# Altium project BaseModule.PrjPcb
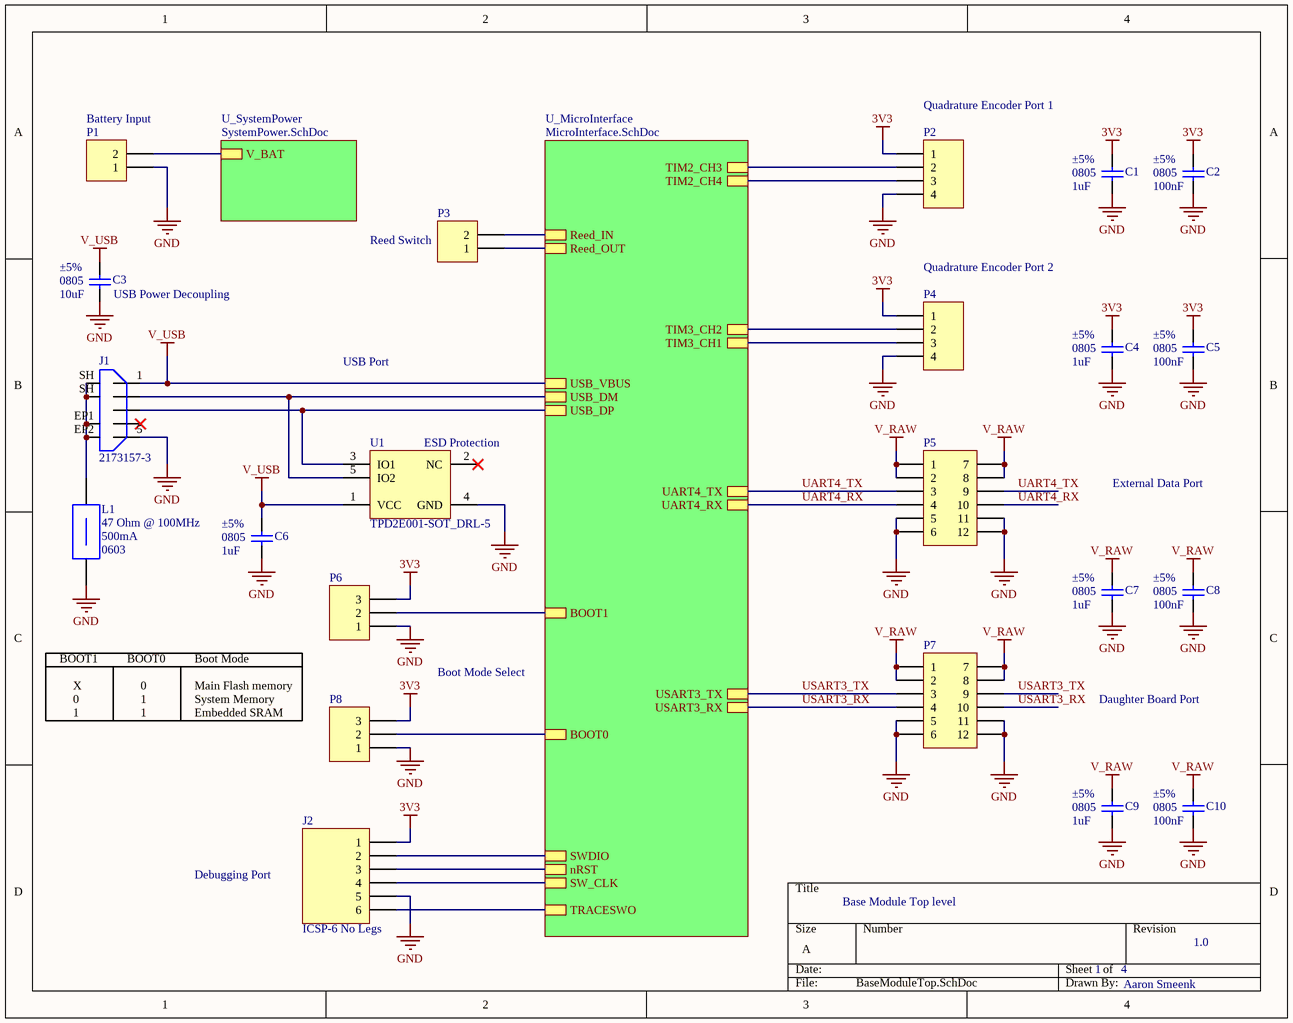
[diagram p0: BaseModuleTop.SchDoc]
4 sheets, 67 parts. Net scope: hierarchical (ports join the sheet entries above them; power ports are global).
Sheets:
  BaseModuleTop.SchDoc
    U_MicroInterface = MicroInterface.SchDoc
      U_Power = Power.SchDoc
    U_SystemPower = SystemPower.SchDoc

## Sheet BaseModuleTop.SchDoc
size A

### Parts
C1  value 1uF  Tolerance: ±5%  Case-EIA: 0805  [CAPC0805(2012)100_M]  (hidden comment: CAP 1uF 6.3V 0805(2012))
C2  value 100nF  Tolerance: ±5%  Case-EIA: 0805  [CAPC0805(2012)100_L]  (hidden comment: CAP 100nF 6.3V 0805(2012))
C3  value 10uF  Tolerance: ±5%  Case-EIA: 0805  [CAPC0805(2012)100_M]  (hidden comment: CAP 10uF 6.3V 0805(2012))
C4  value 1uF  Tolerance: ±5%  Case-EIA: 0805  [CAPC0805(2012)100_M]  (hidden comment: CAP 1uF 6.3V 0805(2012))
C5  value 100nF  Tolerance: ±5%  Case-EIA: 0805  [CAPC0805(2012)100_L]  (hidden comment: CAP 100nF 6.3V 0805(2012))
C6  value 1uF  Tolerance: ±5%  Case-EIA: 0805  [CAPC0805(2012)100_M]  (hidden comment: CAP 1uF 6.3V 0805(2012))
C7  value 1uF  Tolerance: ±5%  Case-EIA: 0805  [CAPC0805(2012)100_M]  (hidden comment: CAP 1uF 6.3V 0805(2012))
C8  value 100nF  Tolerance: ±5%  Case-EIA: 0805  [CAPC0805(2012)100_L]  (hidden comment: CAP 100nF 6.3V 0805(2012))
C9  value 1uF  Tolerance: ±5%  Case-EIA: 0805  [CAPC0805(2012)100_M]  (hidden comment: CAP 1uF 6.3V 0805(2012))
C10  value 100nF  Tolerance: ±5%  Case-EIA: 0805  [CAPC0805(2012)100_L]  (hidden comment: CAP 100nF 6.3V 0805(2012))
J1  2173157-3  [2173157-3]
J2  ICSP-6 No Legs  [TC2030-IDC-NL]
L1  Impedance @ Frequency: 47 Ohm @ 100MHz  Current Rating: 500mA  Package / Case: 0603  [LI0603E470R-10]  (hidden comment: LI0603E470R-10)
P1  Header 2  [HDR1X2]  (value not drawn)
P2  Header 4  [HDR1X4]  (value not drawn)
P3  Header 2  [HDR1X2]  (value not drawn)
P4  Header 4  [HDR1X4]  (value not drawn)
P5  Header 6X2A  [HDR2X6_CEN]  (value not drawn)
P6  Header 3  [HDR1X3]  (value not drawn)
P7  Header 6X2A  [HDR2X6_CEN]  (value not drawn)
P8  Header 3  [HDR1X3]  (value not drawn)
U1  TPD2E001-SOT_DRL-5  [TPD2E001DRLR]

### Sub-sheets
U_MicroInterface = MicroInterface.SchDoc: UART4_TX, UART4_RX, USART3_TX, USART3_RX, SWDIO, SW_CLK, TRACESWO, BOOT1, BOOT0, USB_DP, USB_DM, USB_VBUS, nRST, TIM3_CH1, TIM3_CH2, TIM2_CH4, TIM2_CH3, Reed_IN, Reed_OUT
U_SystemPower = SystemPower.SchDoc: V_BAT

### Nets
3V3: C1.2 C2.2 C4.2 C5.2 J2.1 P2.1 P4.1 P6.3 P8.3
GND: C1.1 C2.1 C3.1 C4.1 C5.1 C6.1 C7.1 C8.1 C9.1 C10.1 J1.5(GND) J2.5 L1.1 P1.1 P2.4 P4.4 P5.5 P5.6 P5.11 P5.12 P6.1 P7.5 P7.6 P7.11 P7.12 P8.1 U1.4(GND)
V_RAW: C7.2 C8.2 C9.2 C10.2 P5.1 P5.2 P5.7 P5.8 P7.1 P7.2 P7.7 P7.8
V_USB: C3.2 C6.2 J1.1(5V) U1.1(VCC) ; sheet U_MicroInterface/USB_VBUS
UART4_RX: P5.4 P5.10 ; sheet U_MicroInterface/UART4_RX
UART4_TX: P5.3 P5.9 ; sheet U_MicroInterface/UART4_TX
USART3_RX: P7.4 P7.10 ; sheet U_MicroInterface/USART3_RX
USART3_TX: P7.3 P7.9 ; sheet U_MicroInterface/USART3_TX
NetC16_2: J2.3 ; sheet U_MicroInterface/nRST
NetJ1_2: J1.2(D-) U1.5(IO2) ; sheet U_MicroInterface/USB_DM
NetJ1_3: J1.3(D+) U1.3(IO1) ; sheet U_MicroInterface/USB_DP
NetJ1_EP1: J1.EP1 J1.EP2 J1.SH L1.2
NetJ2_2: J2.2 ; sheet U_MicroInterface/SWDIO
NetJ2_4: J2.4 ; sheet U_MicroInterface/SW_CLK
NetJ2_6: J2.6 ; sheet U_MicroInterface/TRACESWO
NetP1_2: P1.2 ; sheet U_SystemPower/V_BAT
NetP2_2: P2.2 ; sheet U_MicroInterface/TIM2_CH3
NetP2_3: P2.3 ; sheet U_MicroInterface/TIM2_CH4
NetP3_1: P3.1 ; sheet U_MicroInterface/Reed_OUT
NetP3_2: P3.2 ; sheet U_MicroInterface/Reed_IN
NetP4_2: P4.2 ; sheet U_MicroInterface/TIM3_CH2
NetP4_3: P4.3 ; sheet U_MicroInterface/TIM3_CH1
NetP6_2: P6.2 ; sheet U_MicroInterface/BOOT1
NetP8_2: P8.2 ; sheet U_MicroInterface/BOOT0

Not connected (* = marked no-connect by the designer): J1 4(ID)*; U1 2(NC)*

### Notes on the sheet
- (near P1) Battery Input
- (near P2) Quadrature Encoder Port 1
- (near C3) USB Power Decoupling
- (near P3) Reed Switch
- (near P4) Quadrature Encoder Port 2
- USB Port
- (near U1) ESD Protection
- External Data Port
- BOOT1
- X
- 0
- BOOT0
- 1
- Boot Mode
- Main Flash memory
- System Memory
- Boot Mode Select
- Daughter Board Port
- Embedded SRAM
- Debugging Port
- Base Module Top level
- 4
- 1.0
- Aaron Smeenk

### Library data of the parts
C1 C4 C6 C7 C9 = CMP-1036-04730-1: CAP 1uF 6.3V ±5% 0805 (2012 Metric) Thickness 1mm SMD; Case-Metric: 2012; Technology: SMT; Max Thickness: 1 mm; Rated Voltage: 6.3 V
C2 C5 C8 C10 = CMP-1036-04390-1: CAP 100nF 6.3V ±5% 0805 (2012 Metric) Thickness 1mm SMD; Case-Metric: 2012; Rated Voltage: 6.3 V; Technology: SMT; Max Thickness: 1 mm
C3 = CMP-1036-04730-1: CAP 10uF 6.3V ±5% 0805 (2012 Metric) Thickness 1mm SMD; Case-Metric: 2012; Technology: SMT; Max Thickness: 1 mm; Rated Voltage: 6.3 V
J1 = 2173157-3: USB Connectors SPLASH PROOF MICRO 5P USB B-TYPE; Number of Ports: 1; Number of Contacts: 5; Gender: Female; Brand: TE Connectivity; Mounting Angle: Right; Product: Micro USB Type B Connectors; Standard: USB 2.0; Termination Style: SMD; Contact Material: Copper Alloy; Contact Plating: Gold; Shell Plating: Tin
J2 = ICSP-6 No Legs: 6 Pin Connector
L1 = LI0603E470R-10: FERRITE CHIP 47 OHMS 500MA 0603; DC Resistance (DCR): 100 mOhm Max; Filter Type: Differential Mode - Single; Height (Max): 0.037" (0.95mm)
P1 P3 = Header 2: Header, 2-Pin; LatestRevisionDate: 17-Jul-2002; LatestRevisionNote: Re-released for DXP Platform.; Publisher: Altium Limited
P2 P4 = Header 4: Header, 4-Pin; LatestRevisionDate: 17-Jul-2002; LatestRevisionNote: Re-released for DXP Platform.; Publisher: Altium Limited
P5 P7 = Header 6X2A: Header, 6-Pin, Dual row; LatestRevisionDate: 17-Jul-2002; LatestRevisionNote: Re-released for DXP Platform.; Publisher: Altium Limited
P6 P8 = Header 3: Header, 3-Pin; LatestRevisionDate: 17-Jul-2002; LatestRevisionNote: Re-released for DXP Platform.; Publisher: Altium Limited
U1 = TPD2E001DRLR: TVS DIODE 5.5VWM 100VC SOT5; Bidirectional Channels: 2; Voltage - Reverse Standoff (Typ): 5.5V (Max); Voltage - Breakdown (Min): 11V; Voltage - Clamping (Max) @ Ipp: 100V; Power Line Protection: Yes; Type: Steering (Rail to Rail); Operating Temperature: -40°C ~ 85°C (TA); Package / Case: SOT-553; Supplier Device Package: 5-SOT

## Sheet MicroInterface.SchDoc
size A
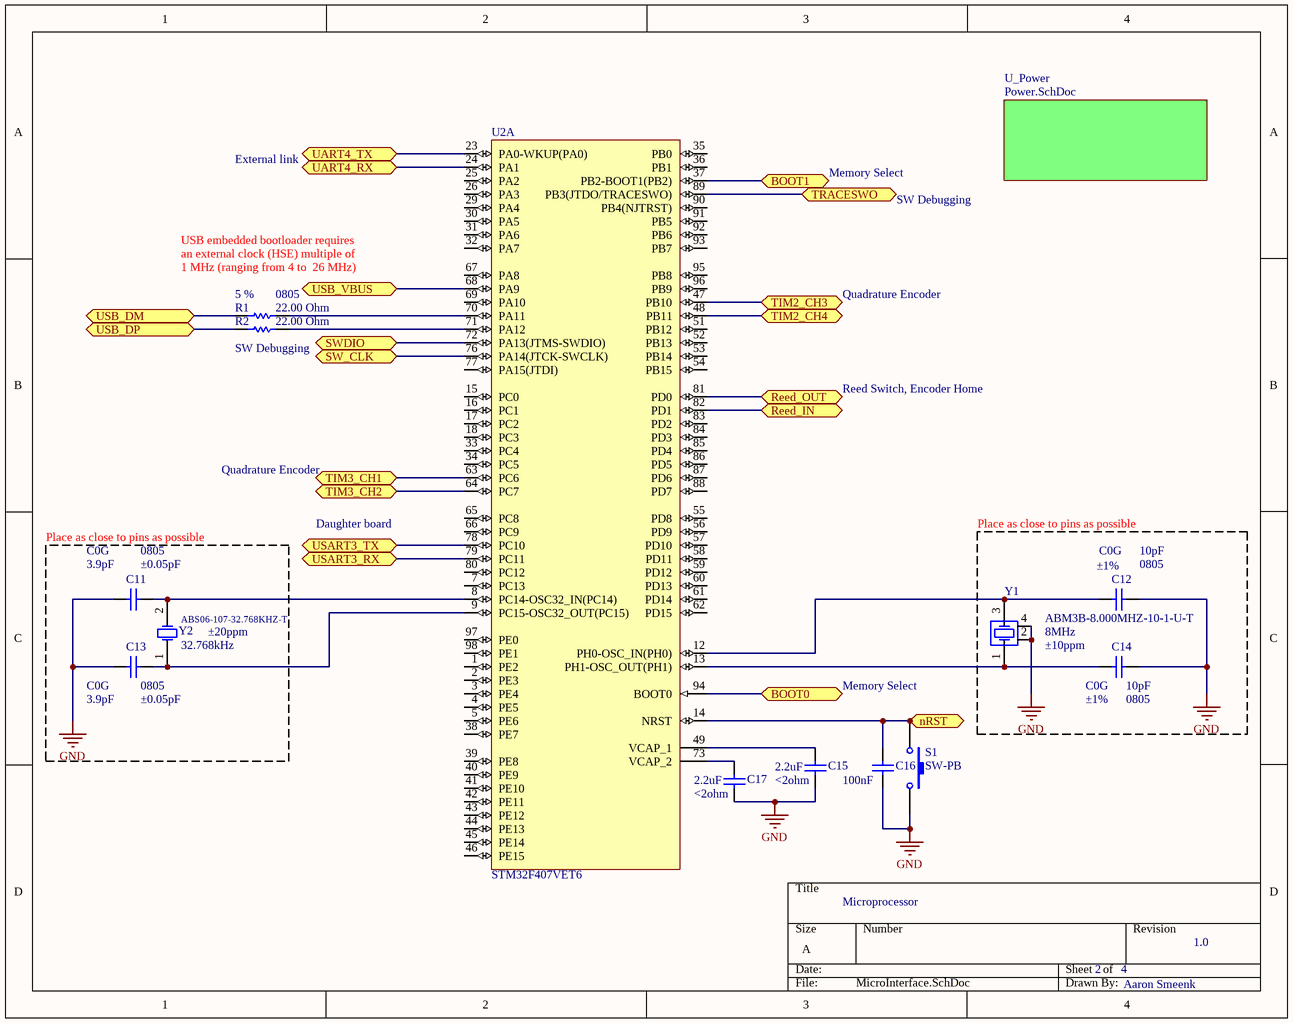
[diagram p1: MicroInterface.SchDoc]

### Parts
C11  value 3.9pF  Case-EIA: 0805  Tolerance: ±0.05pF  Temperature Coefficient: C0G  [CAPC0805(2012)75_L]  (hidden comment: CAP 3.9pF 10V 0805(2012))
C12  value 10pF  Tolerance: ±1%  Case-EIA: 0805  Temperature Coefficient: C0G  [CAPC0805(2012)100_M]  (hidden comment: CAP 10pF 10V 0805(2012))
C13  value 3.9pF  Case-EIA: 0805  Tolerance: ±0.05pF  Temperature Coefficient: C0G  [CAPC0805(2012)75_L]  (hidden comment: CAP 3.9pF 10V 0805(2012))
C14  value 10pF  Tolerance: ±1%  Case-EIA: 0805  Temperature Coefficient: C0G  [CAPC0805(2012)100_M]  (hidden comment: CAP 10pF 10V 0805(2012))
C15  value 2.2uF  ESR: <2ohm  [CAPC0805(2012)145_M]  (hidden comment: CAP 1.5uF 6.3V 0805(2012))
C16  value 100nF  [CAPC0805(2012)145_M]  (hidden comment: CAP 100nF 0805(2012))
C17  value 2.2uF  ESR: <2ohm  [CAPC0805(2012)145_M]  (hidden comment: CAP 1.5uF 6.3V 0805(2012))
R1  value 22.00 Ohm  Tolerance: 5 %  Case-EIA: 0805  [RESC0805(2012)_M]  (hidden comment: 22R 5% 0805(2012))
R2  value 22.00 Ohm  [RESC0805(2012)_M]  (hidden comment: 22R 5% 0805(2012))
S1  SW-PB  [SPST-2]
U2  STM32F407VET6  [STM-LQFP100_M]  (part A of 2)
Y1  ABM3B-8.000MHZ-10-1-U-T  Frequency: 8MHz  Frequency Stability: ±10ppm  [ABM3B Series]
Y2  ABS06-107-32.768KHZ-T  Frequency: 32.768kHz  Frequency Tolerance: ±20ppm  [ABS06-107]

### Blocks framed on the sheet
Place as close to pins as possible: C11 C13 Y2
Place as close to pins as possible: C12 C14 Y1

### Sub-sheets
U_Power = Power.SchDoc: no entries

### Ports
BOOT0, BOOT1, nRST, Reed_IN, Reed_OUT, SW_CLK, SWDIO, TIM2_CH3, TIM2_CH4, TIM3_CH1, TIM3_CH2, TRACESWO, UART4_RX, UART4_TX, USART3_RX, USART3_TX, USB_DM, USB_DP, USB_VBUS

### Nets
GND: C11.1 C12.2 C13.1 C14.2 C15.1 C16.1 C17.1 S1.2 Y1.2 Y1.4
V_USB: U2.68(PA9) ; port USB_VBUS
UART4_RX: U2.24(PA1) ; port UART4_RX
UART4_TX: U2.23(PA0-WKUP(PA0)) ; port UART4_TX
USART3_RX: U2.79(PC11) ; port USART3_RX
USART3_TX: U2.78(PC10) ; port USART3_TX
NetC11_2: C11.2 U2.8(PC14-OSC32_IN(PC14)) Y2.2
NetC12_1: C12.1 U2.12(PH0-OSC_IN(PH0)) Y1.3
NetC13_2: C13.2 U2.9(PC15-OSC32_OUT(PC15)) Y2.1
NetC14_1: C14.1 U2.13(PH1-OSC_OUT(PH1)) Y1.1
NetC15_2: C15.2 U2.49(VCAP_1)
NetC16_2: C16.2 S1.1 U2.14(NRST) ; port nRST
NetC17_2: C17.2 U2.73(VCAP_2)
NetJ1_2: R1.1 ; port USB_DM
NetJ1_3: R2.1 ; port USB_DP
NetJ2_2: U2.72(PA13(JTMS-SWDIO)) ; port SWDIO
NetJ2_4: U2.76(PA14(JTCK-SWCLK)) ; port SW_CLK
NetJ2_6: U2.89(PB3(JTDO/TRACESWO)) ; port TRACESWO
NetP2_2: U2.47(PB10) ; port TIM2_CH3
NetP2_3: U2.48(PB11) ; port TIM2_CH4
NetP3_1: U2.81(PD0) ; port Reed_OUT
NetP3_2: U2.82(PD1) ; port Reed_IN
NetP4_2: U2.64(PC7) ; port TIM3_CH2
NetP4_3: U2.63(PC6) ; port TIM3_CH1
NetP6_2: U2.37(PB2-BOOT1(PB2)) ; port BOOT1
NetP8_2: U2.94(BOOT0) ; port BOOT0
NetR1_2: R1.2 U2.70(PA11)
NetR2_2: R2.2 U2.71(PA12)

Not connected (* = marked no-connect by the designer): U2 1(PE2) 2(PE3) 3(PE4) 4(PE5) 5(PE6) 7(PC13) 15(PC0) 16(PC1) 17(PC2) 18(PC3) 25(PA2) 26(PA3) 29(PA4) 30(PA5) 31(PA6) 32(PA7) 33(PC4) 34(PC5) 35(PB0) 36(PB1) 38(PE7) 39(PE8) 40(PE9) 41(PE10) 42(PE11) 43(PE12) 44(PE13) 45(PE14) 46(PE15) 51(PB12) 52(PB13) 53(PB14) 54(PB15) 55(PD8) 56(PD9) 57(PD10) 58(PD11) 59(PD12) 60(PD13) 61(PD14) 62(PD15) 65(PC8) 66(PC9) 67(PA8) 69(PA10) 77(PA15(JTDI)) 80(PC12) 83(PD2) 84(PD3) 85(PD4) 86(PD5) 87(PD6) 88(PD7) 90(PB4(NJTRST)) 91(PB5) 92(PB6) 93(PB7) 95(PB8) 96(PB9) 97(PE0) 98(PE1)

### Notes on the sheet
- External link
- Memory Select
- SW Debugging
- USB embedded bootloader requires
- an external clock (HSE) multiple of
- 1 MHz (ranging from 4 to  26 MHz)
- Quadrature Encoder
- (near R2) SW Debugging
- Reed Switch, Encoder Home
- Daughter board
- Microprocessor
- 2
- 4
- 1.0
- Aaron Smeenk

### Library data of the parts
C11 C13 = CMP-1036-00455-1: CAP 3.9pF 10V ±0.1pF 0805 (2012 Metric) Thickness 0.75mm SMD; Manufacturer Part Number: GRM1555C1H4R0WA01D; Case-Metric: 2012; Rated Voltage: 10 V; Max Thickness: 0.75 mm; Technology: SMT
C12 C14 = CMP-1036-00821-1: CAP 10pF 10V ±0.25pF 0805 (2012 Metric) Thickness 1mm SMD; Case-Metric: 2012; Max Thickness: 1 mm; Rated Voltage: 10 V; Technology: SMT
C15 C17 = CMP-1036-04784-1: CAP 1.5uF 6.3V ±20% 0805 (2012 Metric) Thickness 1.45mm SMD; Case-EIA: 0805; Case-Metric: 2012; Max Thickness: 1.45 mm; Technology: SMT; Rated Voltage: 6.3 V; Tolerance: ±20%
C16 = CMP-1036-04784-1: CAP 1.5uF 6.3V ±20% 0805 (2012 Metric) Thickness 1.45mm SMD; Case-EIA: 0805; Case-Metric: 2012; ESR: <2ohm; Max Thickness: 1.45 mm; Technology: SMT; Rated Voltage: 6.3 V; Tolerance: ±20%
R1 = CMP-1013-00034-1: 22R 0.125W 5% 0805 (2012 Metric)  SMD; Case-Metric: 2012; Power: 0.125 W; Technology: SMT
R2 = CMP-1013-00034-1: 22R 0.125W 5% 0805 (2012 Metric)  SMD; Case-Metric: 2012; Case-EIA: 0805; Power: 0.125 W; Technology: SMT; Tolerance: 5 %
S1 = SW-PB: Switch; Published: 24-Mar-1999; LatestRevisionDate: 17-Jul-2002; LatestRevisionNote: Re-released for DXP Platform.; PackageReference: SPST-2; Publisher: Altium Limited; PackageDescription: Switch; 2 Leads
U2 = CMP-0243-00016-3: ARM Cortex-M4 32-bit MCU+FPU, 210 DMIPS, 512 kB Flash, 192 kB Internal RAM, 82 I/Os, 100-pin LQFP, -40 to 85 degC, Tray; Manufacturer: STMicroelectronics; Supply Voltage(Vcc) max (V): 3.6; Supply Voltage(Vcc) min (V): 1.8; I/Os (High Current): 82; FLASH Size (Prog) (kB): 512; Operating Frequency(F) (Processor speed) (MHz): 168; D/A Converter: 2x12-bit; Internal RAM Size (kB): 192; PackageReference: LQFP100; Core: ARM Cortex-M4; ComponentLink1URL: http://www.st.com/web/en/home.html; ComponentLink1Description: Manufacturer URL; DatasheetVersion: Rev. 4; Packing: Tray; Mounting Technology: Surface Mount; ComponentLink2Description: Datasheet; ComponentLink2URL: http://www.st.com/st-web-ui/static/active/en/resource/technical/document/datasheet/DM00037051.pdf; ComponentLink3Description: Package Specification; PartNumber: STM32F407VET6; PackageVersion: Rev. 1, 06/2013; PackageDescription: 100-Pin Low Profile Quad Flat Package, 14 x 14 mm Body, 0.5 mm Pitch; ComponentLink3URL: http://www.st.com/st-web-ui/static/active/en/resource/technical/document/data_brief/DM00071938.pdf; PartId: 1
Y1 = ABM3B Series: CRYSTAL 8MHZ 10PF SMD; ESR (Equivalent Series Resistance): 200 Ohm; Operating Mode: Fundamental; Frequency Tolerance: ±10ppm; Load Capacitance: 10pF; Operating Temperature: -10°C ~ 60°C; Package / Case: 4-SMD, No Lead (DFN, LCC)
Y2 = ABS06-107: CRYSTAL 32.768 KHZ 4PF SMD; ESR (Equivalent Series Resistance): 60 kOhm; Operating Mode: Fundamental; Type: kHz Crystal (Tuning Fork); Load Capacitance: 4pF; Operating Temperature: -40°C ~ 85°C; Package / Case: 0805 (2012 Metric); Size / Dimension: 0.079" L x 0.047" W (2.00mm x 1.20mm); Height: 0.024" (0.60mm)

## Sheet Power.SchDoc
size A
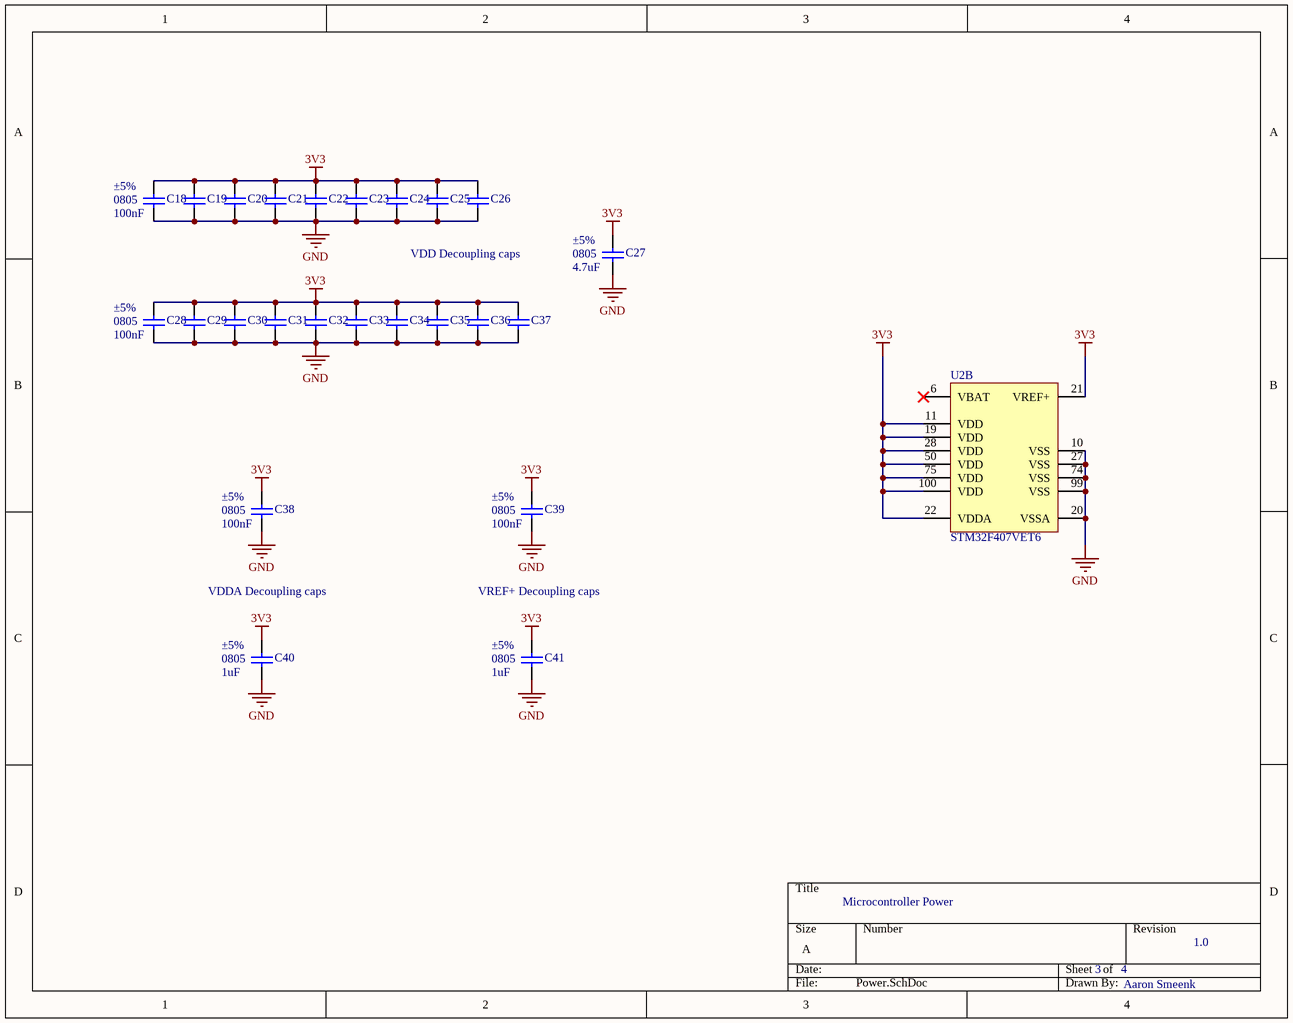
[diagram p2: Power.SchDoc]

### Parts
C18  value 100nF  Tolerance: ±5%  Case-EIA: 0805  [CAPC0805(2012)100_L]  (hidden comment: CAP 100nF 6.3V 0805(2012))
C19  CAP 100nF 6.3V 0805(2012)  [CAPC0805(2012)100_L]  (value not drawn)
C20  CAP 100nF 6.3V 0805(2012)  [CAPC0805(2012)100_L]  (value not drawn)
C21  CAP 100nF 6.3V 0805(2012)  [CAPC0805(2012)100_L]  (value not drawn)
C22  CAP 100nF 6.3V 0805(2012)  [CAPC0805(2012)100_L]  (value not drawn)
C23  CAP 100nF 6.3V 0805(2012)  [CAPC0805(2012)100_L]  (value not drawn)
C24  CAP 100nF 6.3V 0805(2012)  [CAPC0805(2012)100_L]  (value not drawn)
C25  CAP 100nF 6.3V 0805(2012)  [CAPC0805(2012)100_L]  (value not drawn)
C26  CAP 100nF 6.3V 0805(2012)  [CAPC0805(2012)100_L]  (value not drawn)
C27  value 4.7uF  Case-EIA: 0805  Tolerance: ±5%  [CAPC0805(2012)145_N]  (hidden comment: CAP 4.7uF 6.3V 0805(2012))
C28  value 100nF  Tolerance: ±5%  Case-EIA: 0805  [CAPC0805(2012)100_L]  (hidden comment: CAP 100nF 6.3V 0805(2012))
C29  CAP 100nF 6.3V 0805(2012)  [CAPC0805(2012)100_L]  (value not drawn)
C30  CAP 100nF 6.3V 0805(2012)  [CAPC0805(2012)100_L]  (value not drawn)
C31  CAP 100nF 6.3V 0805(2012)  [CAPC0805(2012)100_L]  (value not drawn)
C32  CAP 100nF 6.3V 0805(2012)  [CAPC0805(2012)100_L]  (value not drawn)
C33  CAP 100nF 6.3V 0805(2012)  [CAPC0805(2012)100_L]  (value not drawn)
C34  CAP 100nF 6.3V 0805(2012)  [CAPC0805(2012)100_L]  (value not drawn)
C35  CAP 100nF 6.3V 0805(2012)  [CAPC0805(2012)100_L]  (value not drawn)
C36  CAP 100nF 6.3V 0805(2012)  [CAPC0805(2012)100_L]  (value not drawn)
C37  CAP 100nF 6.3V 0805(2012)  [CAPC0805(2012)100_L]  (value not drawn)
C38  value 100nF  Tolerance: ±5%  Case-EIA: 0805  [CAPC0805(2012)100_L]  (hidden comment: CAP 100nF 6.3V 0805(2012))
C39  value 100nF  Tolerance: ±5%  Case-EIA: 0805  [CAPC0805(2012)100_L]  (hidden comment: CAP 100nF 6.3V 0805(2012))
C40  value 1uF  Case-EIA: 0805  Tolerance: ±5%  [CAPC0805(2012)145_N]  (hidden comment: CAP 1uF 6.3V 0805(2012))
C41  value 1uF  Case-EIA: 0805  Tolerance: ±5%  [CAPC0805(2012)145_N]  (hidden comment: CAP 1uF 6.3V 0805(2012))
U2  STM32F407VET6  [STM-LQFP100_M]  (part B of 2)

### Nets
3V3: C18.2 C19.2 C20.2 C21.2 C22.2 C23.2 C24.2 C25.2 C26.2 C27.2 C28.2 C29.2 C30.2 C31.2 C32.2 C33.2 C34.2 C35.2 C36.2 C37.2 C38.2 C39.2 C40.2 C41.2 U2.11(VDD) U2.19(VDD) U2.21(VREF+) U2.22(VDDA) U2.28(VDD) U2.50(VDD) U2.75(VDD) U2.100(VDD)
GND: C18.1 C19.1 C20.1 C21.1 C22.1 C23.1 C24.1 C25.1 C26.1 C27.1 C28.1 C29.1 C30.1 C31.1 C32.1 C33.1 C34.1 C35.1 C36.1 C37.1 C38.1 C39.1 C40.1 C41.1 U2.10(VSS) U2.20(VSSA) U2.27(VSS) U2.74(VSS) U2.99(VSS)

Not connected (* = marked no-connect by the designer): U2 6(VBAT)*

### Notes on the sheet
- VDD Decoupling caps
- VDDA Decoupling caps
- VREF+ Decoupling caps
- Microcontroller Power
- 3
- 4
- 1.0
- Aaron Smeenk

### Library data of the parts
C18 C28 C38 C39 = CMP-1036-04390-1: as C2 on sheet BaseModuleTop; Rated Voltage: 6.3 V; Technology: SMT; Max Thickness: 1 mm
C19-C26 C29-C37 = CMP-1036-04390-1: CAP 100nF 6.3V ±5% 0805 (2012 Metric) Thickness 1mm SMD; Case-Metric: 2012; Case-EIA: 0805; Tolerance: ±5%; Value: 100nF; Rated Voltage: 6.3 V; Technology: SMT; Max Thickness: 1 mm
C27 = CMP-1036-04781-1: CAP 4.7uF 6.3V ±5% 0805 (2012 Metric) Thickness 1.45mm SMD; Case-Metric: 2012; Rated Voltage: 6.3 V; Technology: SMT; Max Thickness: 1.45 mm
C40 C41 = CMP-1036-04781-1: CAP 1uF 6.3V ±5% 0805 (2012 Metric) Thickness 1.45mm SMD; Case-Metric: 2012; Rated Voltage: 6.3 V; Technology: SMT; Max Thickness: 1.45 mm
U2 = CMP-0243-00016-3: as U2 on sheet MicroInterface; PackageReference: LQFP100; Core: ARM Cortex-M4; ComponentLink1URL: http://www.st.com/web/en/home.html; ComponentLink1Description: Manufacturer URL; DatasheetVersion: Rev. 4; Packing: Tray; Mounting Technology: Surface Mount; ComponentLink2Description: Datasheet; ComponentLink2URL: http://www.st.com/st-web-ui/static/active/en/resource/technical/document/datasheet/DM00037051.pdf; ComponentLink3Description: Package Specification; PartNumber: STM32F407VET6; PackageVersion: Rev. 1, 06/2013; PackageDescription: 100-Pin Low Profile Quad Flat Package, 14 x 14 mm Body, 0.5 mm Pitch; ComponentLink3URL: http://www.st.com/st-web-ui/static/active/en/resource/technical/document/data_brief/DM00071938.pdf; PartId: 1

## Sheet SystemPower.SchDoc
size A
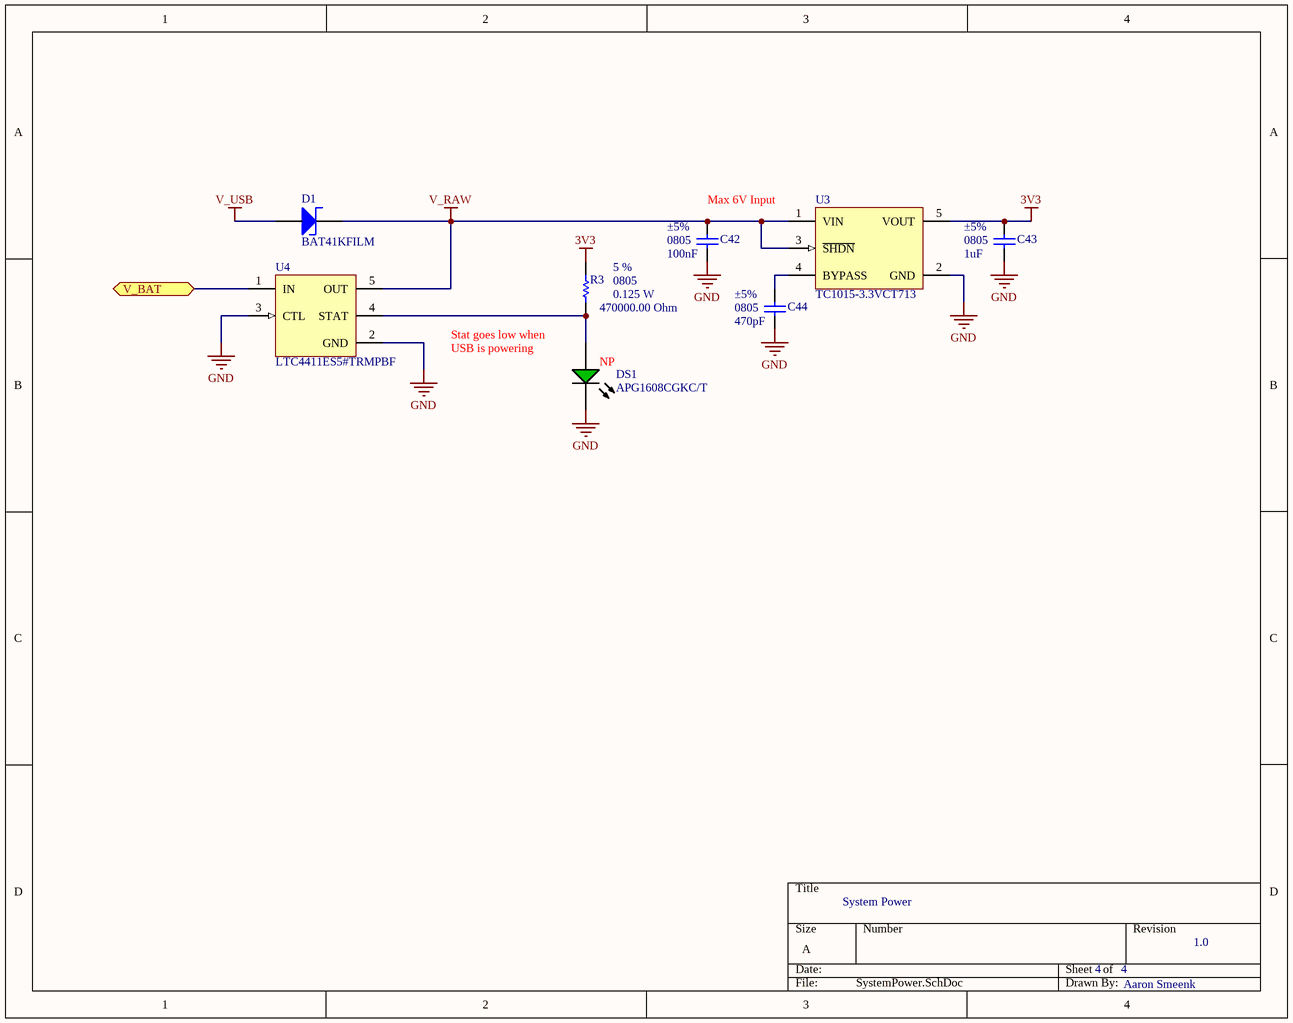
[diagram p3: SystemPower.SchDoc]

### Parts
C42  value 100nF  Tolerance: ±5%  Case-EIA: 0805  [CAPC0805(2012)100_L]  (hidden comment: CAP 100nF 6.3V 0805(2012))
C43  value 1uF  Tolerance: ±5%  Case-EIA: 0805  [CAPC0805(2012)100_M]  (hidden comment: CAP 1uF 6.3V 0805(2012))
C44  value 470pF  Case-EIA: 0805  Tolerance: ±5%  [CAPC0805(2012)100_L]  (hidden comment: CAP 470pF 6.3V 0805(2012))
D1  BAT41KFILM  [BAT41KFILM]
DS1  APG1608CGKC/T  [KING-LED0603-25-GREEN_V]
R3  value 470000.00 Ohm  Power: 0.125 W  Tolerance: 5 %  Case-EIA: 0805  [RESC0805(2012)_M]  (hidden comment: 470K 5% 0805(2012))
U3  TC1015-3.3VCT713  [SOT-23-CT5_M]
U4  LTC4411ES5#TRMPBF  [LT-S5-5-TSOT-23_N]

### Ports
V_BAT

### Nets
3V3: C43.2 R3.2 U3.5(VOUT)
GND: C42.1 C43.1 C44.1 DS1.2(K) U3.2(GND) U4.2(GND) U4.3(CTL)
V_RAW: C42.2 D1.1 U3.1(VIN) U3.3(~{SHDN}) U4.5(OUT)
V_USB: D1.2
NetC44_2: C44.2 U3.4(BYPASS)
NetDS1_1: DS1.1(A) R3.1 U4.4(STAT)
NetP1_2: U4.1(IN) ; port V_BAT

### Notes on the sheet
- Max 6V Input
- Stat goes low when
- USB is powering
- (near DS1) NP
- System Power
- 4
- 1.0
- Aaron Smeenk

### Library data of the parts
C42 = CMP-1036-04390-1: as C2 on sheet BaseModuleTop; Rated Voltage: 6.3 V; Technology: SMT; Max Thickness: 1 mm
C43 = CMP-1036-04730-1: as C1 on sheet BaseModuleTop; Technology: SMT; Max Thickness: 1 mm; Rated Voltage: 6.3 V
C44 = CMP-1036-02639-1: CAP 470pF 6.3V ±5% 0805 (2012 Metric) Thickness 1mm SMD; Case-Metric: 2012; Rated Voltage: 6.3 V; Technology: SMT; Max Thickness: 1 mm
D1 = BAT41KFILM: DIODE SCHOTTKY 100V 200MA SOD523; Current - Average Rectified (Io): 200mA (DC); Voltage - Forward (Vf) (Max) @ If: 1V @ 200mA; Speed: Small Signal =< 200mA (Io), Any Speed; Current - Reverse Leakage @ Vr: 100nA @ 50V; Capacitance @ Vr, F: 10pF @ 1V, 1MHz; Diode Type: Schottky; Voltage - DC Reverse (Vr) (Max): 100V; Package / Case: SOD-523
DS1 = CMP-0239-00001-1: LED, SMT, 0603(1608), 0.25mm Thickness, Green; Forward Current: 30 mA; Reverse Voltage: 5 V; Power Dissipation: 78 mW; Packing: Reel; ComponentLink1Description: Manufacturer URL; ComponentLink1URL: http://www.kingbrightusa.com/; ComponentLink2URL: http://www.kingbrightusa.com/images/catalog/SPEC/APG1608CGKC-T.pdf; Mounting Technology: Surface Mount; Storage Temperature: -40 to 85 degC; DatasheetVersion: Rev. 5B, 10/2012; PartNumber: APG1608CGKC/T; PackageReference: LED0603-25-GREEN; ComponentLink2Description: Datasheet; PackageDescription: 2-Pin SMT LED, 1.6 x 0.8 mm Body, 0.25mm Thickness; PackageVersion: Rev. 5B, 10/2012
R3 = CMP-1013-00138-1: 470K 0.125W 5% 0805 (2012 Metric)  SMD; Case-Metric: 2012; Technology: SMT
U3 = CMP-0136-00586-1: 50 mA, 100 mA and 150 mA CMOS LDOs with Active-Low Shutdown and Reference Bypass, 5-Pin SOT-23, Extended Temperature, Tape and Reel; PackageDescription: 5-Lead Plastic Small Outline Transistor (CT) [SOT-23]; PackageReference: SOT-23-CT5; PackageVersion: revBB, Aug-2009; DatasheetVersion: revE, Feb-2007; Code_IPC: SOT23-5
U4 = CMP-0479-00414-1: Integrated Switch: Replaces Power Supply OR, 2.6 to 5.5 V Vin, 5-pin SOT23 (S5-5), -40 to 85 degC, Pb-Free, Mini Tape and Reel; Manufacturer: Linear Technology; Ideal Diode: Single, Internal, P-Channel; ComponentLink2Description: Datasheet; ComponentLink1URL: http://www.linear.com/; RoHS: TRUE; PackageDescription: 5-Pin Plastic TSOT-23, Body 1.63 x 2.90 mm, Pitch 0.95 mm; PackageReference: S5-5; Mounting Technology: Surface Mount; PackageVersion: Jun-10; ComponentLink3URL: http://cds.linear.com/docs/en/packaging/SOT_5_05-08-1635.pdf; PartNumber: LTC4411ES5#TRMPBF; ComponentLink3Description: Package Specification; Code_JEDEC: MO-193; ComponentLink2URL: http://cds.linear.com/docs/en/datasheet/4411fa.pdf; Packing: Mini Tape and Reel; ComponentLink1Description: Manufacturer URL; DatasheetVersion: Rev. A

## Nets that join several sheets
3V3: BaseModuleTop (9 pins), Power (32 pins), SystemPower (C43.2 R3.2 U3.5)
GND: BaseModuleTop (27 pins), MicroInterface (10 pins), Power (29 pins), SystemPower (7 pins)
V_RAW: BaseModuleTop (12 pins), SystemPower (5 pins)
V_USB: BaseModuleTop (C3.2 C6.2 J1.1 U1.1), MicroInterface (U2.68), SystemPower (D1.2)
NetC16_2: BaseModuleTop (J2.3), MicroInterface (C16.2 S1.1 U2.14)
NetJ1_2: BaseModuleTop (J1.2 U1.5), MicroInterface (R1.1)
NetJ1_3: BaseModuleTop (J1.3 U1.3), MicroInterface (R2.1)
NetJ2_2: BaseModuleTop (J2.2), MicroInterface (U2.72)
NetJ2_4: BaseModuleTop (J2.4), MicroInterface (U2.76)
NetJ2_6: BaseModuleTop (J2.6), MicroInterface (U2.89)
NetP1_2: BaseModuleTop (P1.2), SystemPower (U4.1)
NetP2_2: BaseModuleTop (P2.2), MicroInterface (U2.47)
NetP2_3: BaseModuleTop (P2.3), MicroInterface (U2.48)
NetP3_1: BaseModuleTop (P3.1), MicroInterface (U2.81)
NetP3_2: BaseModuleTop (P3.2), MicroInterface (U2.82)
NetP4_2: BaseModuleTop (P4.2), MicroInterface (U2.64)
NetP4_3: BaseModuleTop (P4.3), MicroInterface (U2.63)
NetP6_2: BaseModuleTop (P6.2), MicroInterface (U2.37)
NetP8_2: BaseModuleTop (P8.2), MicroInterface (U2.94)
UART4_RX: BaseModuleTop (P5.4 P5.10), MicroInterface (U2.24)
UART4_TX: BaseModuleTop (P5.3 P5.9), MicroInterface (U2.23)
USART3_RX: BaseModuleTop (P7.4 P7.10), MicroInterface (U2.79)
USART3_TX: BaseModuleTop (P7.3 P7.9), MicroInterface (U2.78)